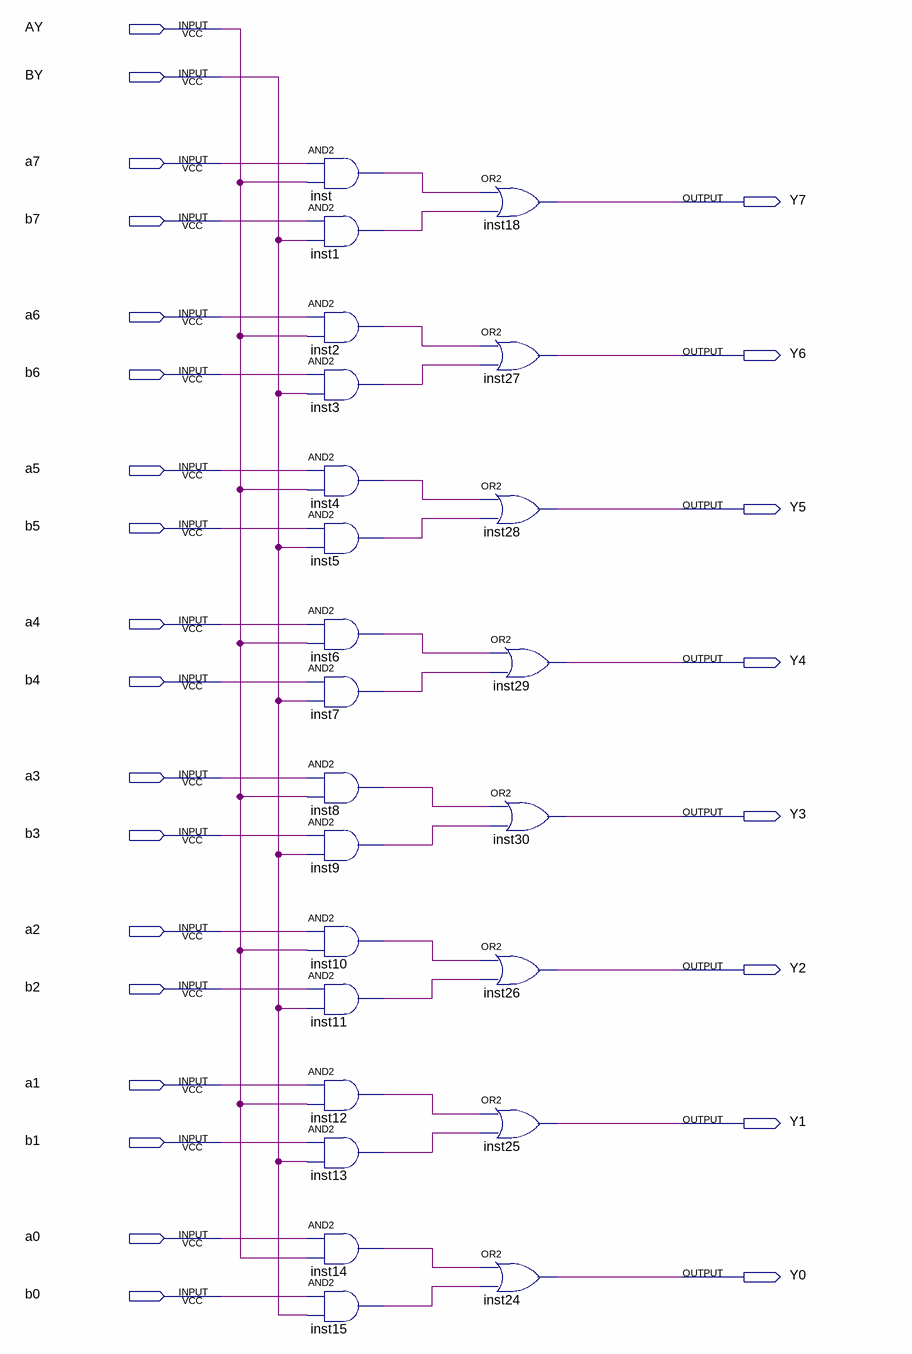
[diagram p0: schematic sheet]
// Quartus schematic chooser.bdf as structural Verilog: 24 symbols, 26 pins
module chooser (
  input  AY,
  input  BY,
  input  a7,
  input  b7,
  input  a6,
  input  b6,
  input  a5,
  input  b5,
  input  a4,
  input  b4,
  input  a3,
  input  b3,
  input  a2,
  input  b2,
  input  a1,
  input  b1,
  input  a0,
  input  b0,
  output Y7,
  output Y6,
  output Y5,
  output Y4,
  output Y3,
  output Y2,
  output Y1,
  output Y0
);

  wire inst1_out, inst2_out, inst3_out, inst4_out, inst5_out, inst6_out, inst7_out, inst8_out, inst9_out,
       inst10_out, inst11_out, inst12_out, inst13_out, inst14_out, inst15_out, inst_out;

  and inst (inst_out, a7, AY);
  and inst1 (inst1_out, b7, BY);
  and inst2 (inst2_out, a6, AY);
  and inst3 (inst3_out, b6, BY);
  and inst4 (inst4_out, a5, AY);
  and inst5 (inst5_out, b5, BY);
  and inst6 (inst6_out, a4, AY);
  and inst7 (inst7_out, b4, BY);
  and inst8 (inst8_out, a3, AY);
  and inst9 (inst9_out, b3, BY);
  and inst10 (inst10_out, a2, AY);
  and inst11 (inst11_out, b2, BY);
  and inst12 (inst12_out, a1, AY);
  and inst13 (inst13_out, b1, BY);
  and inst14 (inst14_out, a0, AY);
  and inst15 (inst15_out, b0, BY);
  or inst18 (Y7, inst_out, inst1_out);
  or inst27 (Y6, inst2_out, inst3_out);
  or inst28 (Y5, inst4_out, inst5_out);
  or inst26 (Y2, inst10_out, inst11_out);
  or inst25 (Y1, inst12_out, inst13_out);
  or inst24 (Y0, inst14_out, inst15_out);
  or inst29 (Y4, inst6_out, inst7_out);
  or inst30 (Y3, inst8_out, inst9_out);
endmodule
